# EAGLE design MEMS_audio_board (EAGLE 7.6.0)
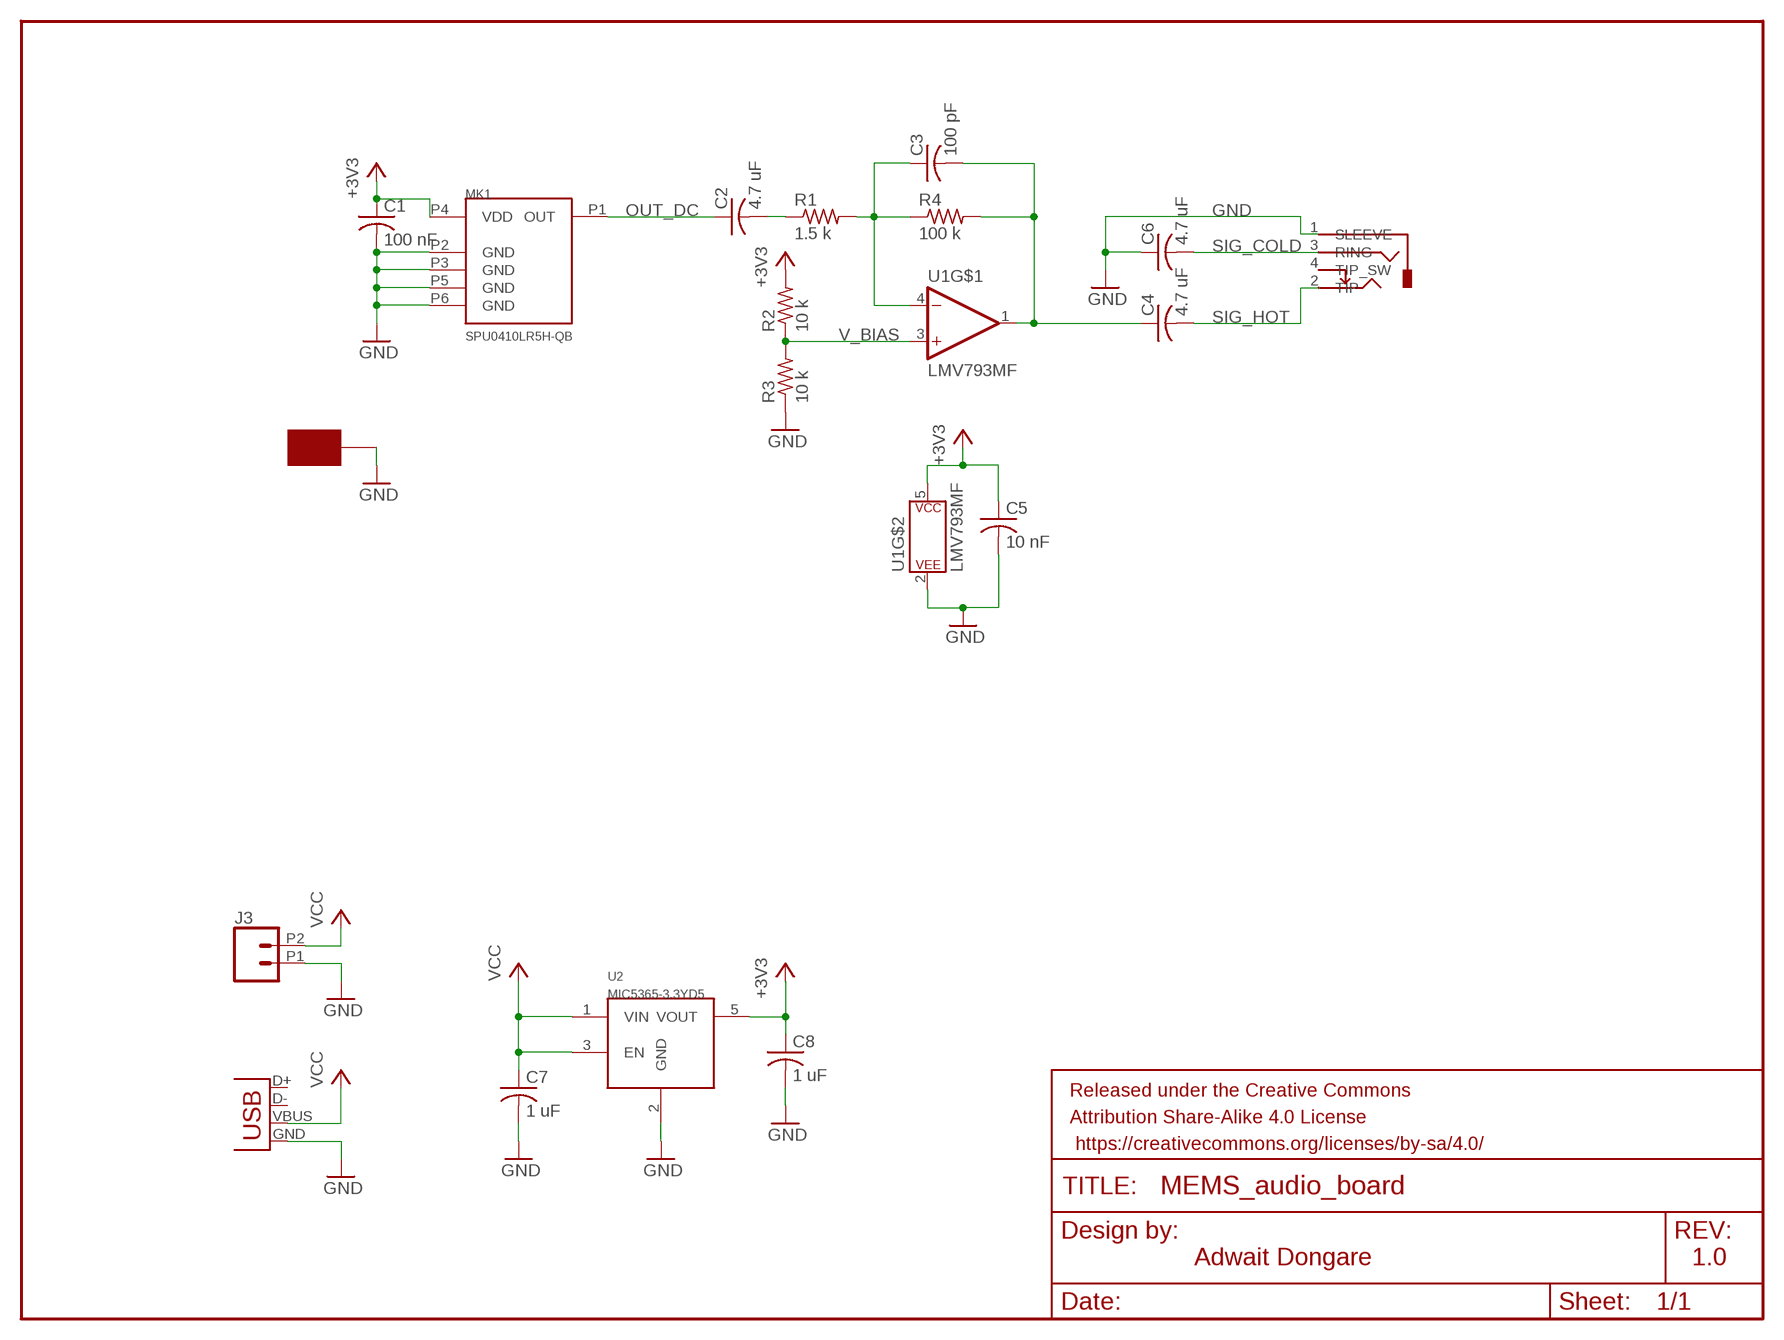
[diagram p0: schematic, sheet 1]

## Parts
C1  100 nF  C-USC0603  [C0603]
C2  4.7 uF  C-USC0603  [C0603]
C3  100 pF  C-USC0603  [C0603]
C4  4.7 uF  C-USC0603  [C0603]
C5  10 nF  C-USC0603  [C0603]
C6  4.7 uF  C-USC0603  [C0603]
C7  1 uF  C-USC0603  [C0603]
C8  1 uF  C-USC0603  [C0603]
FRAME1  FRAME-LETTERNO_PACKAGE  [DUMMY]
J1  SJ-2524-SMT  [SJ-2524-SMT]
J2  USBSMD  [USB-MINIB]
J3  CONN_022.54MM_SCREWTERM  [1X02_2.54_SCREWTERM]
MK1  SPU0410LR5H-QB  [SPU0410LR5H-QB]
R1  1.5 k  R-US_R0603  [R0603]
R2  10 k  R-US_R0603  [R0603]
R3  10 k  R-US_R0603  [R0603]
R4  100 k  R-US_R0603  [R0603]
TP  TEST_PAD-0.4X0.1  [TESTPAD_10.16X2.54]
U1  LMV793MF  [SOT23-5]
U2  MIC5365-3.3YD5  MIC5365-X.XXYD5  [SOT23-5]

## Nets
+3V3: C1.1 C5.1 C8.1 MK1.P4(VDD) R2.2 U1.5(P$V+) U2.5(VOUT)
GND: C1.2 C5.2 C6.1 C7.2 C8.2 J1.1(SLEEVE) J2.GND J3.P1 MK1.P2(GND) MK1.P3(GND) MK1.P5(GND) MK1.P6(GND) R3.1 TP.P$1 U1.2(P$V-) U2.2(GND)
N$3: C3.1 R1.2 R4.1 U1.4(-IN)
N$4: C3.2 C4.1 R4.2 U1.1(OUT)
OUT_AC: C2.2 R1.1
OUT_DC: C2.1 MK1.P1(OUT)
SIG_COLD: C6.2 J1.3(RING)
SIG_HOT: C4.2 J1.2(TIP)
V_BIAS: R2.1 R3.2 U1.3(+IN)
VCC: C7.1 J2.VBUS J3.P2 U2.1(VIN) U2.3(EN)
Unconnected: J1.4(TIP_SW) J2.D+ J2.D-

## Notes on the sheet
- Adwait Dongare | 1.0

## Library data of the parts
C1-C8 = rcl:C-US: CAPACITOR, American symbol
FRAME1 = SparkFun-Aesthetics:FRAME-LETTER: Schematic Frame - Letter Standard 8.5x11 US Letter frame; DESIGNER: Nobody; VERSION: v01
J1 = Audio_Board_Parts:SJ-2524-SMT
J2 = SparkFun:USB: USB Connectors USB-B-PTH is fully proven SKU : PRT-00139 USB-miniB is fully proven SKU : PRT-00587 USB-A-PCB is untested. USB-A-H is throughly reviewed, but untested. Spark Fun Electronics SKU : PRT-00437 USB-B-SMT is throughly reviewed, but untested. Needs silkscreen touching up. USB-A-S has not been used/tested USB-MB-H has not been used/tested
J3 = SparkFun-Connectors:CONN_02: Multi connection point. Often used as Generic Header-pin footprint for 0.1 inch spaced/style header connections On any of the 0.1 inch spaced packages, you can populate with these: Break Away Headers - Straight <https://www.sparkfun.com/products/116> (PRT-00116) Break Away Male Headers - Right Angle <https://www.sparkfun.com/products/553> (PRT-00553) Female Headers <https://www.sparkfun.com/products/115> (PRT-00115) Break Away Headers - Machine Pin <https://www.sparkfun.com/products/117> (PRT-00117) Break Away Female Headers - Swiss Machine Pin <https://www.sparkfun.com/products/743> (PRT-00743) For SCREWTERMINALS and SPRING TERMINALS visit here: Screw Terimnals on SparkFun.com <https://www.sparkfun.com/search/results?term=Screw+Terminals> (5mm/3.5mm/2.54mm spacing) This device is also useful as a general connection point to wire up your design to another part of your project. Our various solder wires solder well into these plated through hole pads. Hook-Up Wire - Assortment (Stranded, 22 AWG) <https://www.sparkfun.com/products/11375> (PRT-11375) Hook-Up Wire - Assortment (Solid Core, 22 AWG) <https://www.sparkfun.com/products/11367> (PRT-11367) View the entire wire category on our website here <https://www.sparkfun.com/categories/141> Special notes: Molex polarized connector foot print use with: PRT-08233 with associated crimp pins and housings. 2.54_SCREWTERM for use with PRT-10571. 3.5mm Screw Terminal footprints for PRT-08084 5mm Screw Terminal footprints for use with PRT-08432
MK1 = Audio_Board_Parts:SPU0410: Knowles Zero-Height SiSonic Microphone
R1-R4 = rcl:R-US_: RESISTOR, American symbol
TP = Audio_Board_Parts:TEST_PAD
U1 = Audio_Board_Parts:LMV793: Texas Instruments Low Noise, 88 MHz GBP, 1.8 V CMOS Input Decompensated Operational Amplifiers
U2 = Audio_Board_Parts:MIC5365

## Board
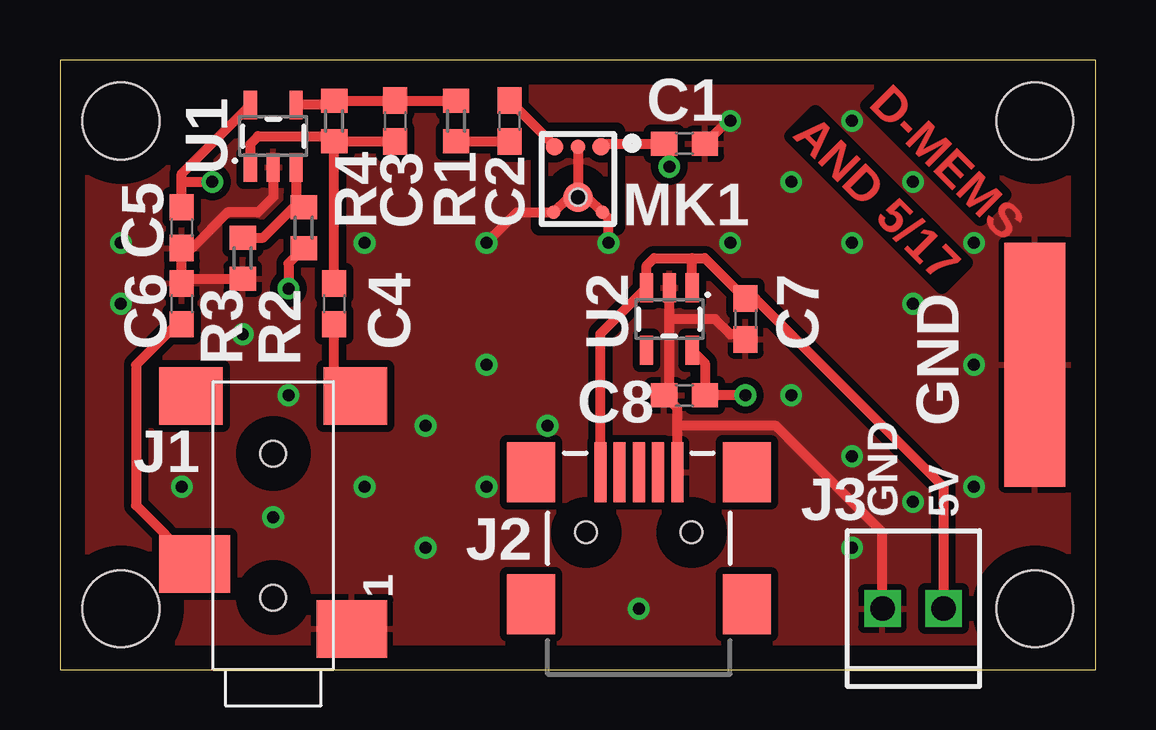
[diagram p1: board, top side]
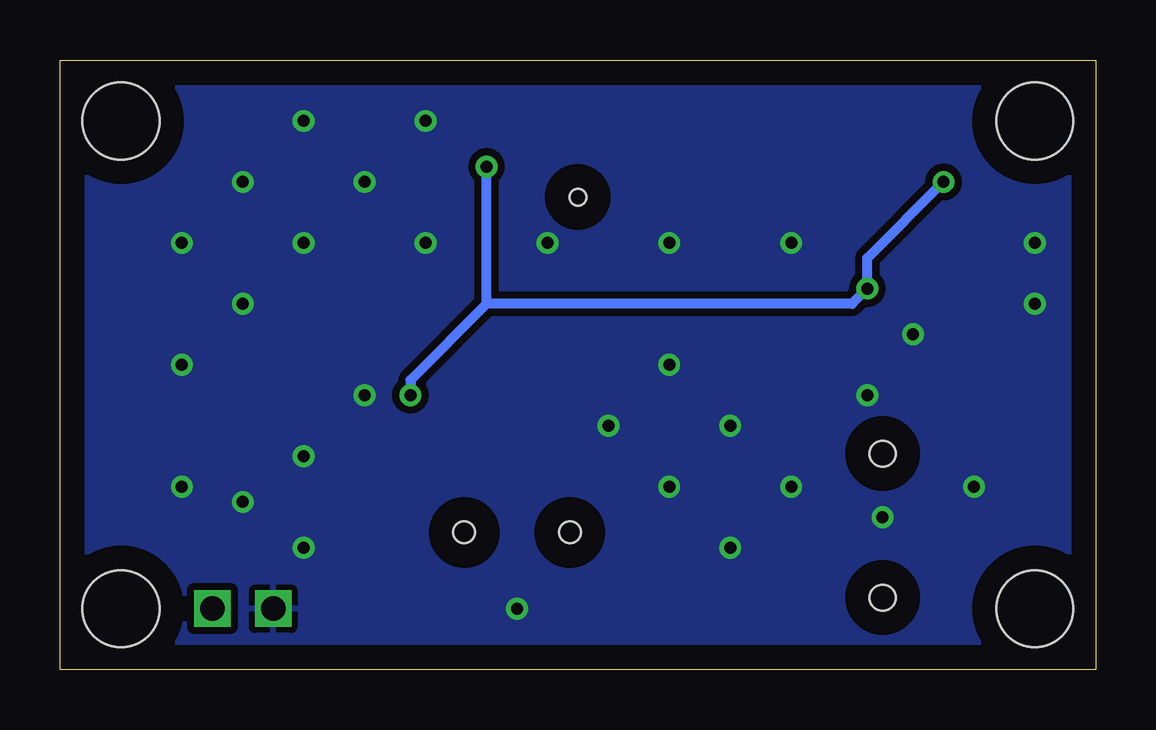
[diagram p2: board, bottom side, seen from below]

Size 43.18 x 25.4 mm. Coordinates in mm from the lower left corner, seen from the top.
Outline: 0,0 43.18,0 43.18,25.4 0,25.4 0,0
Copper layers (1*16): Top 0.035mm / dielectric 1.5mm / Bottom 0.035mm
Design rules "default": minimum track width 10mil, minimum drill 24mil, track to track 8mil, track to pad 8mil, pad to pad 8mil, via to via 8mil, smd to smd 8mil, copper to edge 40mil, drill to drill 8mil, minimum pad ring 10mil, minimum via ring 8mil, stop-mask expansion 4mil, vias tented up to drill 0mil, thermal gap 10mil
Holes 3.2 mm at 2.54,22.86 40.64,22.86 40.64,2.54 2.54,2.54

### Footprints (pad centres in the part's own frame; a part is rotated, then mirrored left to right if it is on the bottom)
C0603 = smd 1.1 x 1: 1 -0.85,0; 2 0.85,0
SJ-2524-SMT = smd 2.4 x 2.95: 1 1.7,-3.275; 3 4.4,3.275 | smd 2.4 x 2.65: 2 11.4,-3.425; 4 11.4,3.425 | hole 1.07: 3,0; 9,0
USB-MINIB = smd 2.5 x 0.5: D+ 2.5,0; D- 2.5,0.8; GND 2.5,-1.6; ID 2.5,-0.8; VBUS 2.5,1.6 | smd 2.5 x 2: GND@1 -3,-4.5; GND@2 -3,4.5; GND@3 2.5,4.5; GND@4 2.5,-4.5 | hole 0.9: 0,2.2; 0,-2.2
1X02_2.54_SCREWTERM = drill 1.016 square: P1 2.54,0; P2 0,0
SPU0410LR5H-QB = smd 0.723 x 0.723: P1 -0.966,2.103; P4 0.966,2.103 | smd 0.562 x 0.562: P2 -1.015,-0.634; P3 1.015,-0.634 | smd 0.612 x 0.612: P5 0,2.103 | smd 1.224 x 1.224: P6 0,0 | hole 0.7: 0,0
R0603 = smd 1 x 1.1: 1 -0.85,0; 2 0.85,0
TESTPAD_10.16X2.54 = smd 10.16 x 2.54: P$1 0,0
SOT23-5 = smd 0.55 x 1.2: 1 -0.95,-1.3; 2 0,-1.3; 3 0.95,-1.3; 4 0.95,1.3; 5 -0.95,1.3

### Placement (x,y rotation side)
C1  26.04,21.91 0 top
C2  18.73,22.86 270 top
C3  13.97,22.86 270 top
C4  11.43,15.24 270 top
C5  5.08,18.41 270 top
C6  5.08,15.24 270 top
C7  28.57,14.61 270 top
C8  26.04,11.43 180 top
FRAME1  -1.27,0 0 top
J1  8.89,0 90 top
J2  24.13,5.71 90 top
J3  36.83,2.54 180 top
MK1  21.59,19.68 0 top
R1  16.51,22.86 90 top
R2  10.16,18.41 270 top
R3  7.62,17.14 90 top
R4  11.43,22.86 270 top
TP  40.64,12.7 90 top
U1  8.89,22.23 0 top
U2  25.4,14.61 180 top

### Tracks (layer width: path | path; a pad name or v marks a point on that pad's centre or on a via)
+3V3  (via drill 0.5)
  Top 0.406: U2.5 26.89,12.77 C8.1 v28.57,11.43 | 5.08,20.32 5.08,20.66 U1.5 | C5.1 5.08,20.32 | 5.08,20.32 v6.35,20.32 | R2.2 9.53,16.93 v9.53,15.88 | MK1.P4 22.68,21.91 C1.1 25.4,21.69 v25.4,20.95
  Bottom 0.406: 25.4,15.24 10.16,15.24 v9.53,15.88 9.53,17.14 v6.35,20.32 | 25.4,15.24 28.57,12.06 v28.57,11.43 | 25.4,15.24 v25.4,20.95
GND  (via drill 0.5)
  Top 0.406: 25.4,14.61 25.4,11.64 C8.2 25.73,10.88 25.73,10.16 | 25.4,14.61 U2.2 | J2.GND 25.73,10.16 | C7.2 28.36,13.97 27.94,13.97 27.3,14.61 25.4,14.61 | J3.P1 34.29,5.71 29.84,10.16 25.73,10.16 | MK1.P5 MK1.P6 | MK1.P6 21.97,19.68 MK1.P3 22.86,18.8 v22.86,17.78 | R3.1 5.29,16.3 C6.1 C5.2 5.5,17.57 6.99,19.05 8.26,19.05 8.89,19.68 U1.2 | MK1.P6 21.21,19.68 MK1.P2 19.05,19.05 v17.78,17.78 | v27.94,22.86 27.84,22.86 C1.2
  other vias: 2.54,15.24 38.1,17.78 35.56,20.32 33.02,22.86 33.02,17.78 30.48,20.32 27.94,17.78 35.56,15.24 38.1,12.7 12.7,17.78 17.78,12.7 17.78,7.62 12.7,7.62 15.24,5.08 15.24,10.16 20.32,10.16 33.02,5.08 38.1,7.62 24.13,2.54 8.89,6.35 2.54,17.78 7.62,13.97 30.48,11.43 33.02,8.89 35.56,6.99 5.08,7.62 9.53,11.43
  pour Top (isolate 0.305): 0.64,24.77 42.55,24.77 42.55,0.64 0.64,0.64
  pour Bottom (isolate 0.305): 0.64,24.77 42.55,24.77 42.55,0.64 0.64,0.64
N$3
  Top 0.406: U1.4 11.24,23.52 R4.1 C3.1 R1.2
N$4
  Top 0.406: R4.2 C3.2 | C4.1 R4.2 | U1.1 7.94,21.91 8.26,22.23 11.21,22.23 R4.2
OUT_AC
  Top 0.406: R1.1 C2.2
OUT_DC
  Top 0.406: C2.1 20.62,21.82 MK1.P1
SIG_COLD
  Top 0.406: C6.2 4.87,14.39 3.17,12.7 3.17,6.84 J1.3
SIG_HOT
  Top 0.406: J1.2 11.43,12.29 C4.2
V_BIAS
  Top 0.406: U1.3 9.84,19.59 R2.1 9.74,19.27 8.47,18 R3.2
VCC
  Top 0.406: J2.VBUS 22.53,13.98 U2.3 24.45,16.83 24.77,17.14 26.35,17.14 | U2.1 26.35,17.14 | 26.35,17.14 26.89,17.14 C7.1 29,15.46 36.83,7.62 J3.P2

### Text on the board
Top: D-MEMS | AND 5/17
tPlace: GND | GND | 5V